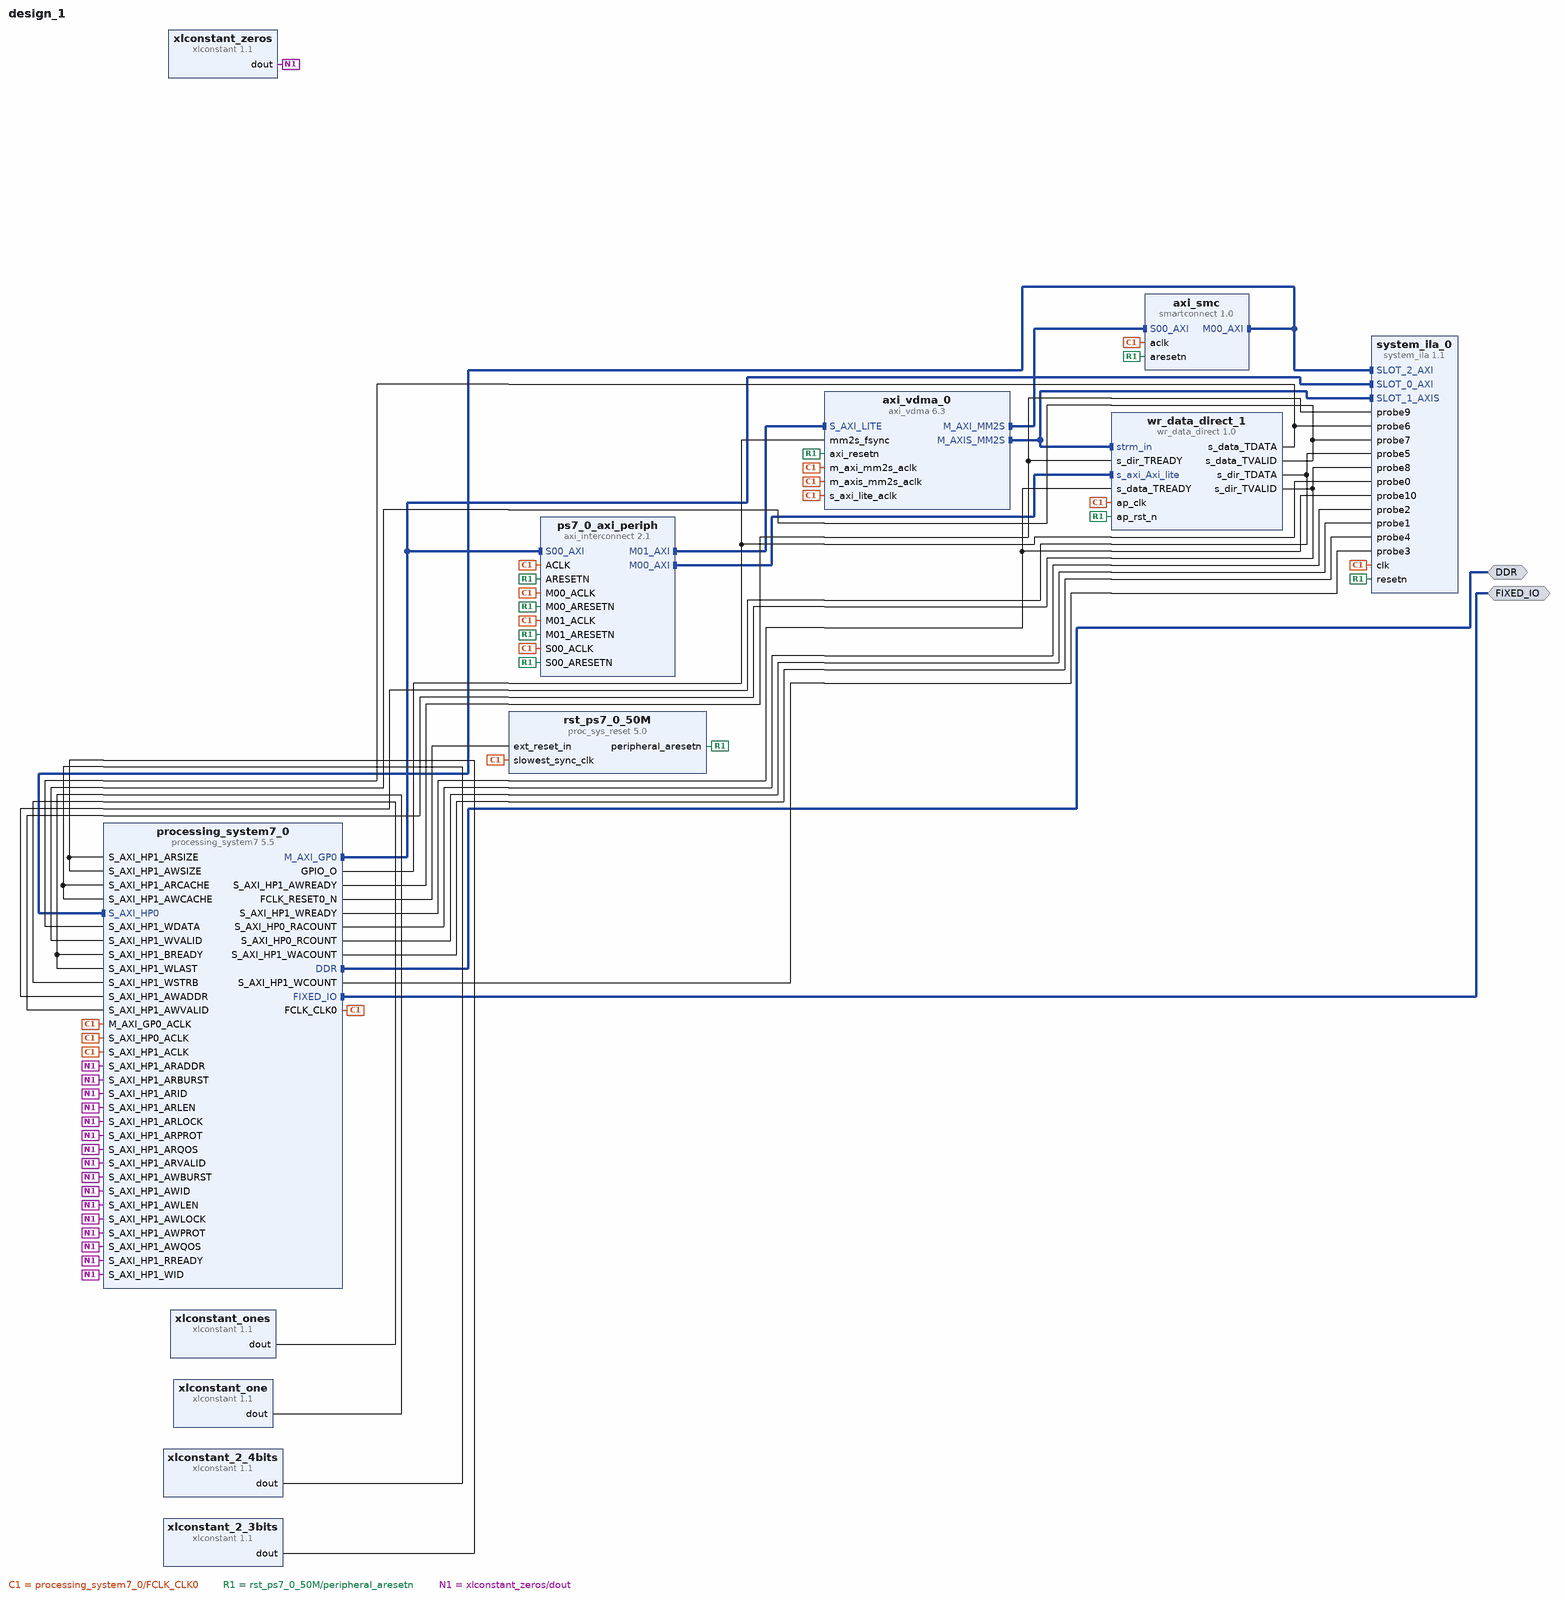
[diagram p0: block diagram of the top level]
# Vivado block design design_1, xc7z020clg400-1, Vivado 2023.1
create_bd_design design_1

create_bd_intf_port -mode Master -vlnv xilinx.com:interface:ddrx_rtl:1.0 DDR
create_bd_intf_port -mode Master -vlnv xilinx.com:display_processing_system7:fixedio_rtl:1.0 FIXED_IO

create_bd_cell -type ip -vlnv xilinx.com:ip:smartconnect:1.0 axi_smc
set_property -dict {CONFIG.NUM_SI 1} [get_bd_cells axi_smc]
create_bd_cell -type ip -vlnv xilinx.com:ip:axi_vdma:6.3 axi_vdma_0
set_property -dict [list \
  CONFIG.c_include_s2mm 0 \
  CONFIG.c_m_axis_mm2s_tdata_width 64 \
  CONFIG.c_mm2s_genlock_mode 0 \
  CONFIG.c_num_fstores 1 \
  CONFIG.c_use_mm2s_fsync 1 \
] [get_bd_cells axi_vdma_0]
create_bd_cell -type ip -vlnv xilinx.com:ip:processing_system7:5.5 processing_system7_0
set_property -dict [list \
  CONFIG.PCW_APU_PERIPHERAL_FREQMHZ 667 \
  CONFIG.PCW_ENET0_ENET0_IO {MIO 16 .. 27} \
  CONFIG.PCW_ENET0_GRP_MDIO_ENABLE 1 \
  CONFIG.PCW_ENET0_GRP_MDIO_IO {MIO 52 .. 53} \
  CONFIG.PCW_ENET0_PERIPHERAL_ENABLE 1 \
  CONFIG.PCW_ENET0_RESET_ENABLE 0 \
  CONFIG.PCW_ENET_RESET_ENABLE 1 \
  CONFIG.PCW_ENET_RESET_SELECT {Share reset pin} \
  CONFIG.PCW_FPGA0_PERIPHERAL_FREQMHZ 166 \
  CONFIG.PCW_GPIO_EMIO_GPIO_ENABLE 1 \
  CONFIG.PCW_GPIO_EMIO_GPIO_IO 1 \
  CONFIG.PCW_GPIO_EMIO_GPIO_WIDTH 1 \
  CONFIG.PCW_GPIO_MIO_GPIO_ENABLE 1 \
  CONFIG.PCW_GPIO_MIO_GPIO_IO MIO \
  CONFIG.PCW_I2C_RESET_ENABLE 1 \
  CONFIG.PCW_PRESET_BANK1_VOLTAGE {LVCMOS 1.8V} \
  CONFIG.PCW_QSPI_GRP_FBCLK_ENABLE 1 \
  CONFIG.PCW_QSPI_GRP_FBCLK_IO {MIO 8} \
  CONFIG.PCW_QSPI_GRP_SINGLE_SS_ENABLE 1 \
  CONFIG.PCW_QSPI_GRP_SINGLE_SS_IO {MIO 1 .. 6} \
  CONFIG.PCW_QSPI_PERIPHERAL_ENABLE 1 \
  CONFIG.PCW_QSPI_QSPI_IO {MIO 1 .. 6} \
  CONFIG.PCW_SD0_GRP_CD_ENABLE 1 \
  CONFIG.PCW_SD0_GRP_CD_IO {MIO 47} \
  CONFIG.PCW_SD0_GRP_WP_ENABLE 0 \
  CONFIG.PCW_SD0_PERIPHERAL_ENABLE 1 \
  CONFIG.PCW_SD0_SD0_IO {MIO 40 .. 45} \
  CONFIG.PCW_SDIO_PERIPHERAL_FREQMHZ 50 \
  CONFIG.PCW_SINGLE_QSPI_DATA_MODE x4 \
  CONFIG.PCW_S_AXI_HP1_DATA_WIDTH 32 \
  CONFIG.PCW_UART1_PERIPHERAL_ENABLE 1 \
  CONFIG.PCW_UART1_UART1_IO {MIO 48 .. 49} \
  CONFIG.PCW_UART_PERIPHERAL_FREQMHZ 100 \
  CONFIG.PCW_UIPARAM_DDR_FREQ_MHZ 533.333333 \
  CONFIG.PCW_UIPARAM_DDR_MEMORY_TYPE {DDR 3 (Low Voltage)} \
  CONFIG.PCW_UIPARAM_DDR_PARTNO {MT41K256M16 RE-125} \
  CONFIG.PCW_USB0_PERIPHERAL_ENABLE 1 \
  CONFIG.PCW_USB0_RESET_ENABLE 1 \
  CONFIG.PCW_USB0_RESET_IO {MIO 46} \
  CONFIG.PCW_USB0_USB0_IO {MIO 28 .. 39} \
  CONFIG.PCW_USB_RESET_ENABLE 1 \
  CONFIG.PCW_USB_RESET_SELECT {Share reset pin} \
  CONFIG.PCW_USE_S_AXI_HP0 1 \
  CONFIG.PCW_USE_S_AXI_HP1 1 \
] [get_bd_cells processing_system7_0]
# 296 more settings of processing_system7_0 are not shown: defaults, MIO pin electricals, DDR timing, and values the tool derives
create_bd_cell -type ip -vlnv xilinx.com:ip:axi_interconnect:2.1 ps7_0_axi_periph
set_property -dict {CONFIG.NUM_MI 2} [get_bd_cells ps7_0_axi_periph]
create_bd_cell -type ip -vlnv xilinx.com:ip:proc_sys_reset:5.0 rst_ps7_0_50M
create_bd_cell -type ip -vlnv xilinx.com:ip:system_ila:1.1 system_ila_0
set_property -dict [list \
  CONFIG.C_DATA_DEPTH 2048 \
  CONFIG.C_MON_TYPE MIX \
  CONFIG.C_NUM_MONITOR_SLOTS 3 \
  CONFIG.C_NUM_OF_PROBES 11 \
  CONFIG.C_PROBE0_TYPE 0 \
  CONFIG.C_PROBE10_TYPE 0 \
  CONFIG.C_PROBE1_TYPE 1 \
  CONFIG.C_PROBE2_TYPE 1 \
  CONFIG.C_PROBE3_TYPE 1 \
  CONFIG.C_PROBE4_TYPE 1 \
  CONFIG.C_PROBE5_TYPE 1 \
  CONFIG.C_PROBE6_TYPE 1 \
  CONFIG.C_PROBE7_TYPE 0 \
  CONFIG.C_PROBE8_TYPE 0 \
  CONFIG.C_PROBE9_TYPE 0 \
  CONFIG.C_SLOT_0_APC_EN 0 \
  CONFIG.C_SLOT_0_AXI_AR_SEL_DATA 1 \
  CONFIG.C_SLOT_0_AXI_AR_SEL_TRIG 0 \
  CONFIG.C_SLOT_0_AXI_AW_SEL_DATA 1 \
  CONFIG.C_SLOT_0_AXI_AW_SEL_TRIG 0 \
  CONFIG.C_SLOT_0_AXI_B_SEL_DATA 1 \
  CONFIG.C_SLOT_0_AXI_B_SEL_TRIG 0 \
  CONFIG.C_SLOT_0_AXI_R_SEL_DATA 1 \
  CONFIG.C_SLOT_0_AXI_R_SEL_TRIG 1 \
  CONFIG.C_SLOT_0_AXI_W_SEL_DATA 1 \
  CONFIG.C_SLOT_0_AXI_W_SEL_TRIG 0 \
  CONFIG.C_SLOT_0_INTF_TYPE xilinx.com:interface:aximm_rtl:1.0 \
  CONFIG.C_SLOT_1_APC_EN 0 \
  CONFIG.C_SLOT_1_AXI_DATA_SEL 1 \
  CONFIG.C_SLOT_1_AXI_TRIG_SEL 0 \
  CONFIG.C_SLOT_1_INTF_TYPE xilinx.com:interface:axis_rtl:1.0 \
  CONFIG.C_SLOT_2_APC_EN 0 \
  CONFIG.C_SLOT_2_AXI_AR_SEL_DATA 1 \
  CONFIG.C_SLOT_2_AXI_AR_SEL_TRIG 0 \
  CONFIG.C_SLOT_2_AXI_AW_SEL_DATA 0 \
  CONFIG.C_SLOT_2_AXI_AW_SEL_TRIG 0 \
  CONFIG.C_SLOT_2_AXI_B_SEL_DATA 0 \
  CONFIG.C_SLOT_2_AXI_B_SEL_TRIG 0 \
  CONFIG.C_SLOT_2_AXI_R_SEL_DATA 1 \
  CONFIG.C_SLOT_2_AXI_R_SEL_TRIG 0 \
  CONFIG.C_SLOT_2_AXI_W_SEL_DATA 0 \
  CONFIG.C_SLOT_2_AXI_W_SEL_TRIG 0 \
  CONFIG.C_SLOT_2_INTF_TYPE xilinx.com:interface:aximm_rtl:1.0 \
  CONFIG.C_SLOT_3_APC_EN 0 \
  CONFIG.C_SLOT_3_AXI_DATA_SEL 1 \
  CONFIG.C_SLOT_3_AXI_TRIG_SEL 0 \
  CONFIG.C_SLOT_3_INTF_TYPE xilinx.com:interface:axis_rtl:1.0 \
  CONFIG.C_SLOT_4_APC_EN 0 \
  CONFIG.C_SLOT_4_AXI_DATA_SEL 1 \
  CONFIG.C_SLOT_4_AXI_TRIG_SEL 0 \
  CONFIG.C_SLOT_4_INTF_TYPE xilinx.com:interface:axis_rtl:1.0 \
  CONFIG.C_SLOT_5_APC_EN 0 \
  CONFIG.C_SLOT_5_AXI_AR_SEL_DATA 0 \
  CONFIG.C_SLOT_5_AXI_AR_SEL_TRIG 0 \
  CONFIG.C_SLOT_5_AXI_AW_SEL_DATA 1 \
  CONFIG.C_SLOT_5_AXI_AW_SEL_TRIG 0 \
  CONFIG.C_SLOT_5_AXI_B_SEL_DATA 1 \
  CONFIG.C_SLOT_5_AXI_B_SEL_TRIG 0 \
  CONFIG.C_SLOT_5_AXI_R_SEL_DATA 0 \
  CONFIG.C_SLOT_5_AXI_R_SEL_TRIG 0 \
  CONFIG.C_SLOT_5_AXI_W_SEL_DATA 1 \
  CONFIG.C_SLOT_5_AXI_W_SEL_TRIG 0 \
  CONFIG.C_SLOT_5_INTF_TYPE xilinx.com:interface:aximm_rtl:1.0 \
] [get_bd_cells system_ila_0]
create_bd_cell -type ip -vlnv xilinx.com:hls:wr_data_direct:1.0 wr_data_direct_1
create_bd_cell -type ip -vlnv xilinx.com:ip:xlconstant:1.1 xlconstant_2_3bits
set_property -dict {CONFIG.CONST_VAL 0x2 CONFIG.CONST_WIDTH 3} [get_bd_cells xlconstant_2_3bits]
create_bd_cell -type ip -vlnv xilinx.com:ip:xlconstant:1.1 xlconstant_2_4bits
set_property -dict {CONFIG.CONST_VAL 0x2 CONFIG.CONST_WIDTH 4} [get_bd_cells xlconstant_2_4bits]
create_bd_cell -type ip -vlnv xilinx.com:ip:xlconstant:1.1 xlconstant_one
create_bd_cell -type ip -vlnv xilinx.com:ip:xlconstant:1.1 xlconstant_ones
set_property -dict {CONFIG.CONST_VAL 0xf CONFIG.CONST_WIDTH 4} [get_bd_cells xlconstant_ones]
create_bd_cell -type ip -vlnv xilinx.com:ip:xlconstant:1.1 xlconstant_zeros
set_property -dict {CONFIG.CONST_VAL 0 CONFIG.CONST_WIDTH 32} [get_bd_cells xlconstant_zeros]

# ---- connections ----

connect_bd_intf_net [get_bd_intf_pins axi_smc/M00_AXI] [get_bd_intf_pins processing_system7_0/S_AXI_HP0]
connect_bd_intf_net [get_bd_intf_pins axi_smc/M00_AXI] [get_bd_intf_pins system_ila_0/SLOT_2_AXI]
connect_bd_intf_net -intf_net axi_vdma_0_M_AXIS_MM2S [get_bd_intf_pins axi_vdma_0/M_AXIS_MM2S] [get_bd_intf_pins wr_data_direct_1/strm_in]
connect_bd_intf_net [get_bd_intf_pins axi_vdma_0/M_AXIS_MM2S] [get_bd_intf_pins system_ila_0/SLOT_1_AXIS]
connect_bd_intf_net [get_bd_intf_pins axi_smc/S00_AXI] [get_bd_intf_pins axi_vdma_0/M_AXI_MM2S]
connect_bd_intf_net [get_bd_intf_ports DDR] [get_bd_intf_pins processing_system7_0/DDR]
connect_bd_intf_net [get_bd_intf_ports FIXED_IO] [get_bd_intf_pins processing_system7_0/FIXED_IO]
connect_bd_intf_net -intf_net processing_system7_0_M_AXI_GP0 [get_bd_intf_pins processing_system7_0/M_AXI_GP0] [get_bd_intf_pins ps7_0_axi_periph/S00_AXI]
connect_bd_intf_net [get_bd_intf_pins processing_system7_0/M_AXI_GP0] [get_bd_intf_pins system_ila_0/SLOT_0_AXI]
connect_bd_intf_net [get_bd_intf_pins ps7_0_axi_periph/M00_AXI] [get_bd_intf_pins wr_data_direct_1/s_axi_Axi_lite]
connect_bd_intf_net [get_bd_intf_pins ps7_0_axi_periph/M01_AXI] [get_bd_intf_pins axi_vdma_0/S_AXI_LITE]
connect_bd_net -net S_AXI_HP0_RACOUNT [get_bd_pins processing_system7_0/S_AXI_HP0_RACOUNT] [get_bd_pins system_ila_0/probe2]
connect_bd_net -net S_AXI_HP0_RCOUNT [get_bd_pins processing_system7_0/S_AXI_HP0_RCOUNT] [get_bd_pins system_ila_0/probe1]
connect_bd_net -net S_AXI_HP1_AWREADY [get_bd_pins processing_system7_0/S_AXI_HP1_AWREADY] \
  [get_bd_pins system_ila_0/probe9] [get_bd_pins wr_data_direct_1/s_dir_TREADY]
connect_bd_net -net S_AXI_HP1_WACOUNT [get_bd_pins processing_system7_0/S_AXI_HP1_WACOUNT] [get_bd_pins system_ila_0/probe4]
connect_bd_net -net S_AXI_HP1_WCOUNT [get_bd_pins processing_system7_0/S_AXI_HP1_WCOUNT] [get_bd_pins system_ila_0/probe3]
connect_bd_net -net S_AXI_HP1_WREADY [get_bd_pins processing_system7_0/S_AXI_HP1_WREADY] \
  [get_bd_pins system_ila_0/probe10] [get_bd_pins wr_data_direct_1/s_data_TREADY]
connect_bd_net [get_bd_pins processing_system7_0/FCLK_CLK0] \
  [get_bd_pins axi_smc/aclk] [get_bd_pins axi_vdma_0/m_axi_mm2s_aclk] [get_bd_pins axi_vdma_0/m_axis_mm2s_aclk] \
  [get_bd_pins axi_vdma_0/s_axi_lite_aclk] [get_bd_pins processing_system7_0/M_AXI_GP0_ACLK] \
  [get_bd_pins processing_system7_0/S_AXI_HP0_ACLK] [get_bd_pins processing_system7_0/S_AXI_HP1_ACLK] \
  [get_bd_pins ps7_0_axi_periph/ACLK] [get_bd_pins ps7_0_axi_periph/M00_ACLK] [get_bd_pins ps7_0_axi_periph/M01_ACLK] \
  [get_bd_pins ps7_0_axi_periph/S00_ACLK] [get_bd_pins rst_ps7_0_50M/slowest_sync_clk] [get_bd_pins system_ila_0/clk] \
  [get_bd_pins wr_data_direct_1/ap_clk]
connect_bd_net [get_bd_pins processing_system7_0/FCLK_RESET0_N] [get_bd_pins rst_ps7_0_50M/ext_reset_in]
connect_bd_net -net processing_system7_0_GPIO_O [get_bd_pins processing_system7_0/GPIO_O] \
  [get_bd_pins axi_vdma_0/mm2s_fsync] [get_bd_pins system_ila_0/probe0]
connect_bd_net [get_bd_pins rst_ps7_0_50M/peripheral_aresetn] \
  [get_bd_pins axi_smc/aresetn] [get_bd_pins axi_vdma_0/axi_resetn] [get_bd_pins ps7_0_axi_periph/ARESETN] \
  [get_bd_pins ps7_0_axi_periph/M00_ARESETN] [get_bd_pins ps7_0_axi_periph/M01_ARESETN] \
  [get_bd_pins ps7_0_axi_periph/S00_ARESETN] [get_bd_pins system_ila_0/resetn] [get_bd_pins wr_data_direct_1/ap_rst_n]
connect_bd_net -net wr_data_direct_1_strm_data [get_bd_pins wr_data_direct_1/s_data_TDATA] \
  [get_bd_pins processing_system7_0/S_AXI_HP1_WDATA] [get_bd_pins system_ila_0/probe6]
connect_bd_net -net wr_data_direct_1_strm_data_ap_vld [get_bd_pins wr_data_direct_1/s_data_TVALID] \
  [get_bd_pins processing_system7_0/S_AXI_HP1_WVALID] [get_bd_pins system_ila_0/probe7]
connect_bd_net -net wr_data_direct_1_strm_dir [get_bd_pins wr_data_direct_1/s_dir_TDATA] \
  [get_bd_pins processing_system7_0/S_AXI_HP1_AWADDR] [get_bd_pins system_ila_0/probe5]
connect_bd_net -net wr_data_direct_1_strm_dir_ap_vld [get_bd_pins wr_data_direct_1/s_dir_TVALID] \
  [get_bd_pins processing_system7_0/S_AXI_HP1_AWVALID] [get_bd_pins system_ila_0/probe8]
connect_bd_net -net xlconstant_0_dout [get_bd_pins xlconstant_ones/dout] [get_bd_pins processing_system7_0/S_AXI_HP1_WSTRB]
connect_bd_net -net xlconstant_0_dout1 [get_bd_pins xlconstant_one/dout] \
  [get_bd_pins processing_system7_0/S_AXI_HP1_BREADY] [get_bd_pins processing_system7_0/S_AXI_HP1_WLAST]
connect_bd_net [get_bd_pins xlconstant_2_4bits/dout] \
  [get_bd_pins processing_system7_0/S_AXI_HP1_ARCACHE] [get_bd_pins processing_system7_0/S_AXI_HP1_AWCACHE]
connect_bd_net -net xlconstant_3_3bits_dout [get_bd_pins xlconstant_2_3bits/dout] \
  [get_bd_pins processing_system7_0/S_AXI_HP1_ARSIZE] [get_bd_pins processing_system7_0/S_AXI_HP1_AWSIZE]
connect_bd_net [get_bd_pins xlconstant_zeros/dout] \
  [get_bd_pins processing_system7_0/S_AXI_HP1_ARADDR] [get_bd_pins processing_system7_0/S_AXI_HP1_ARBURST] \
  [get_bd_pins processing_system7_0/S_AXI_HP1_ARID] [get_bd_pins processing_system7_0/S_AXI_HP1_ARLEN] \
  [get_bd_pins processing_system7_0/S_AXI_HP1_ARLOCK] [get_bd_pins processing_system7_0/S_AXI_HP1_ARPROT] \
  [get_bd_pins processing_system7_0/S_AXI_HP1_ARQOS] [get_bd_pins processing_system7_0/S_AXI_HP1_ARVALID] \
  [get_bd_pins processing_system7_0/S_AXI_HP1_AWBURST] [get_bd_pins processing_system7_0/S_AXI_HP1_AWID] \
  [get_bd_pins processing_system7_0/S_AXI_HP1_AWLEN] [get_bd_pins processing_system7_0/S_AXI_HP1_AWLOCK] \
  [get_bd_pins processing_system7_0/S_AXI_HP1_AWPROT] [get_bd_pins processing_system7_0/S_AXI_HP1_AWQOS] \
  [get_bd_pins processing_system7_0/S_AXI_HP1_RREADY] [get_bd_pins processing_system7_0/S_AXI_HP1_WID]
set_property HDL_ATTRIBUTE.DEBUG true [get_bd_intf_nets axi_vdma_0_M_AXIS_MM2S]
set_property HDL_ATTRIBUTE.MARK_DEBUG true [get_bd_intf_nets axi_vdma_0_M_AXIS_MM2S]
set_property HDL_ATTRIBUTE.DEBUG true [get_bd_intf_nets processing_system7_0_M_AXI_GP0]
set_property HDL_ATTRIBUTE.MARK_DEBUG true [get_bd_intf_nets processing_system7_0_M_AXI_GP0]
set_property HDL_ATTRIBUTE.DEBUG true [get_bd_nets S_AXI_HP0_RACOUNT]
set_property HDL_ATTRIBUTE.MARK_DEBUG true [get_bd_nets S_AXI_HP0_RACOUNT]
set_property HDL_ATTRIBUTE.DEBUG true [get_bd_nets S_AXI_HP0_RCOUNT]
set_property HDL_ATTRIBUTE.MARK_DEBUG true [get_bd_nets S_AXI_HP0_RCOUNT]
set_property HDL_ATTRIBUTE.DEBUG true [get_bd_nets S_AXI_HP1_AWREADY]
set_property HDL_ATTRIBUTE.MARK_DEBUG true [get_bd_nets S_AXI_HP1_AWREADY]
set_property HDL_ATTRIBUTE.DEBUG true [get_bd_nets S_AXI_HP1_WACOUNT]
set_property HDL_ATTRIBUTE.MARK_DEBUG true [get_bd_nets S_AXI_HP1_WACOUNT]
set_property HDL_ATTRIBUTE.DEBUG true [get_bd_nets S_AXI_HP1_WCOUNT]
set_property HDL_ATTRIBUTE.MARK_DEBUG true [get_bd_nets S_AXI_HP1_WCOUNT]
set_property HDL_ATTRIBUTE.DEBUG true [get_bd_nets S_AXI_HP1_WREADY]
set_property HDL_ATTRIBUTE.MARK_DEBUG true [get_bd_nets S_AXI_HP1_WREADY]
set_property HDL_ATTRIBUTE.DEBUG true [get_bd_nets processing_system7_0_GPIO_O]
set_property HDL_ATTRIBUTE.MARK_DEBUG true [get_bd_nets processing_system7_0_GPIO_O]
set_property HDL_ATTRIBUTE.DEBUG true [get_bd_nets wr_data_direct_1_strm_data]
set_property HDL_ATTRIBUTE.MARK_DEBUG true [get_bd_nets wr_data_direct_1_strm_data]
set_property HDL_ATTRIBUTE.DEBUG true [get_bd_nets wr_data_direct_1_strm_data_ap_vld]
set_property HDL_ATTRIBUTE.MARK_DEBUG true [get_bd_nets wr_data_direct_1_strm_data_ap_vld]
set_property HDL_ATTRIBUTE.DEBUG true [get_bd_nets wr_data_direct_1_strm_dir]
set_property HDL_ATTRIBUTE.MARK_DEBUG true [get_bd_nets wr_data_direct_1_strm_dir]
set_property HDL_ATTRIBUTE.DEBUG true [get_bd_nets wr_data_direct_1_strm_dir_ap_vld]
set_property HDL_ATTRIBUTE.MARK_DEBUG true [get_bd_nets wr_data_direct_1_strm_dir_ap_vld]

# ---- address map ----
assign_bd_address -offset 0x00000000 -range 1G -target_address_space [get_bd_addr_spaces axi_vdma_0/Data_MM2S] [get_bd_addr_segs processing_system7_0/S_AXI_HP0/HP0_DDR_LOWOCM]
assign_bd_address -offset 0x40000000 -range 64K -target_address_space [get_bd_addr_spaces processing_system7_0/Data] [get_bd_addr_segs wr_data_direct_1/s_axi_Axi_lite/Reg]
assign_bd_address -offset 0x44A00000 -range 64K -target_address_space [get_bd_addr_spaces processing_system7_0/Data] [get_bd_addr_segs axi_vdma_0/S_AXI_LITE/Reg]

validate_bd_design
save_bd_design
